# Altium schematic sheet Top.SchDoc: {Наименование}
size 420 x 297 mm; ApprovedBy: {Утвердил}; CheckedBy: {Проверил}; DrawnBy: {Разраб.}; DocumentNumber: НРДЦ.ХХХХХХ.ХХХ 00; SheetNumber: 1; SheetTotal: 8; Scale: {Мш.}; PageSetup: Record=PageOptions|CenterHorizontal=False|CenterVertical=False|PrintScale=0.95|XCorrection=0.00|YCorrection=0.00|PrintKind=1|BorderSize=5000000|LeftOffset=0|BottomOffset=0|Orientation=1|PaperLength=1000|PaperWidth=1000|Scale=100|PaperSource=15|PrintQuality=600|MediaType=1|DitherType=10|PaperKind=A4|PrintScaleMode=1; ProcessInspection: {Т.контр.}; Mass: {М.}; NormInspection: {Н.контр.}; Letter1Column: {}; Letter2Column: {}; Letter3Column: {}; DocumentType: {Документ}; Rule: PcbType=ProtelPcb
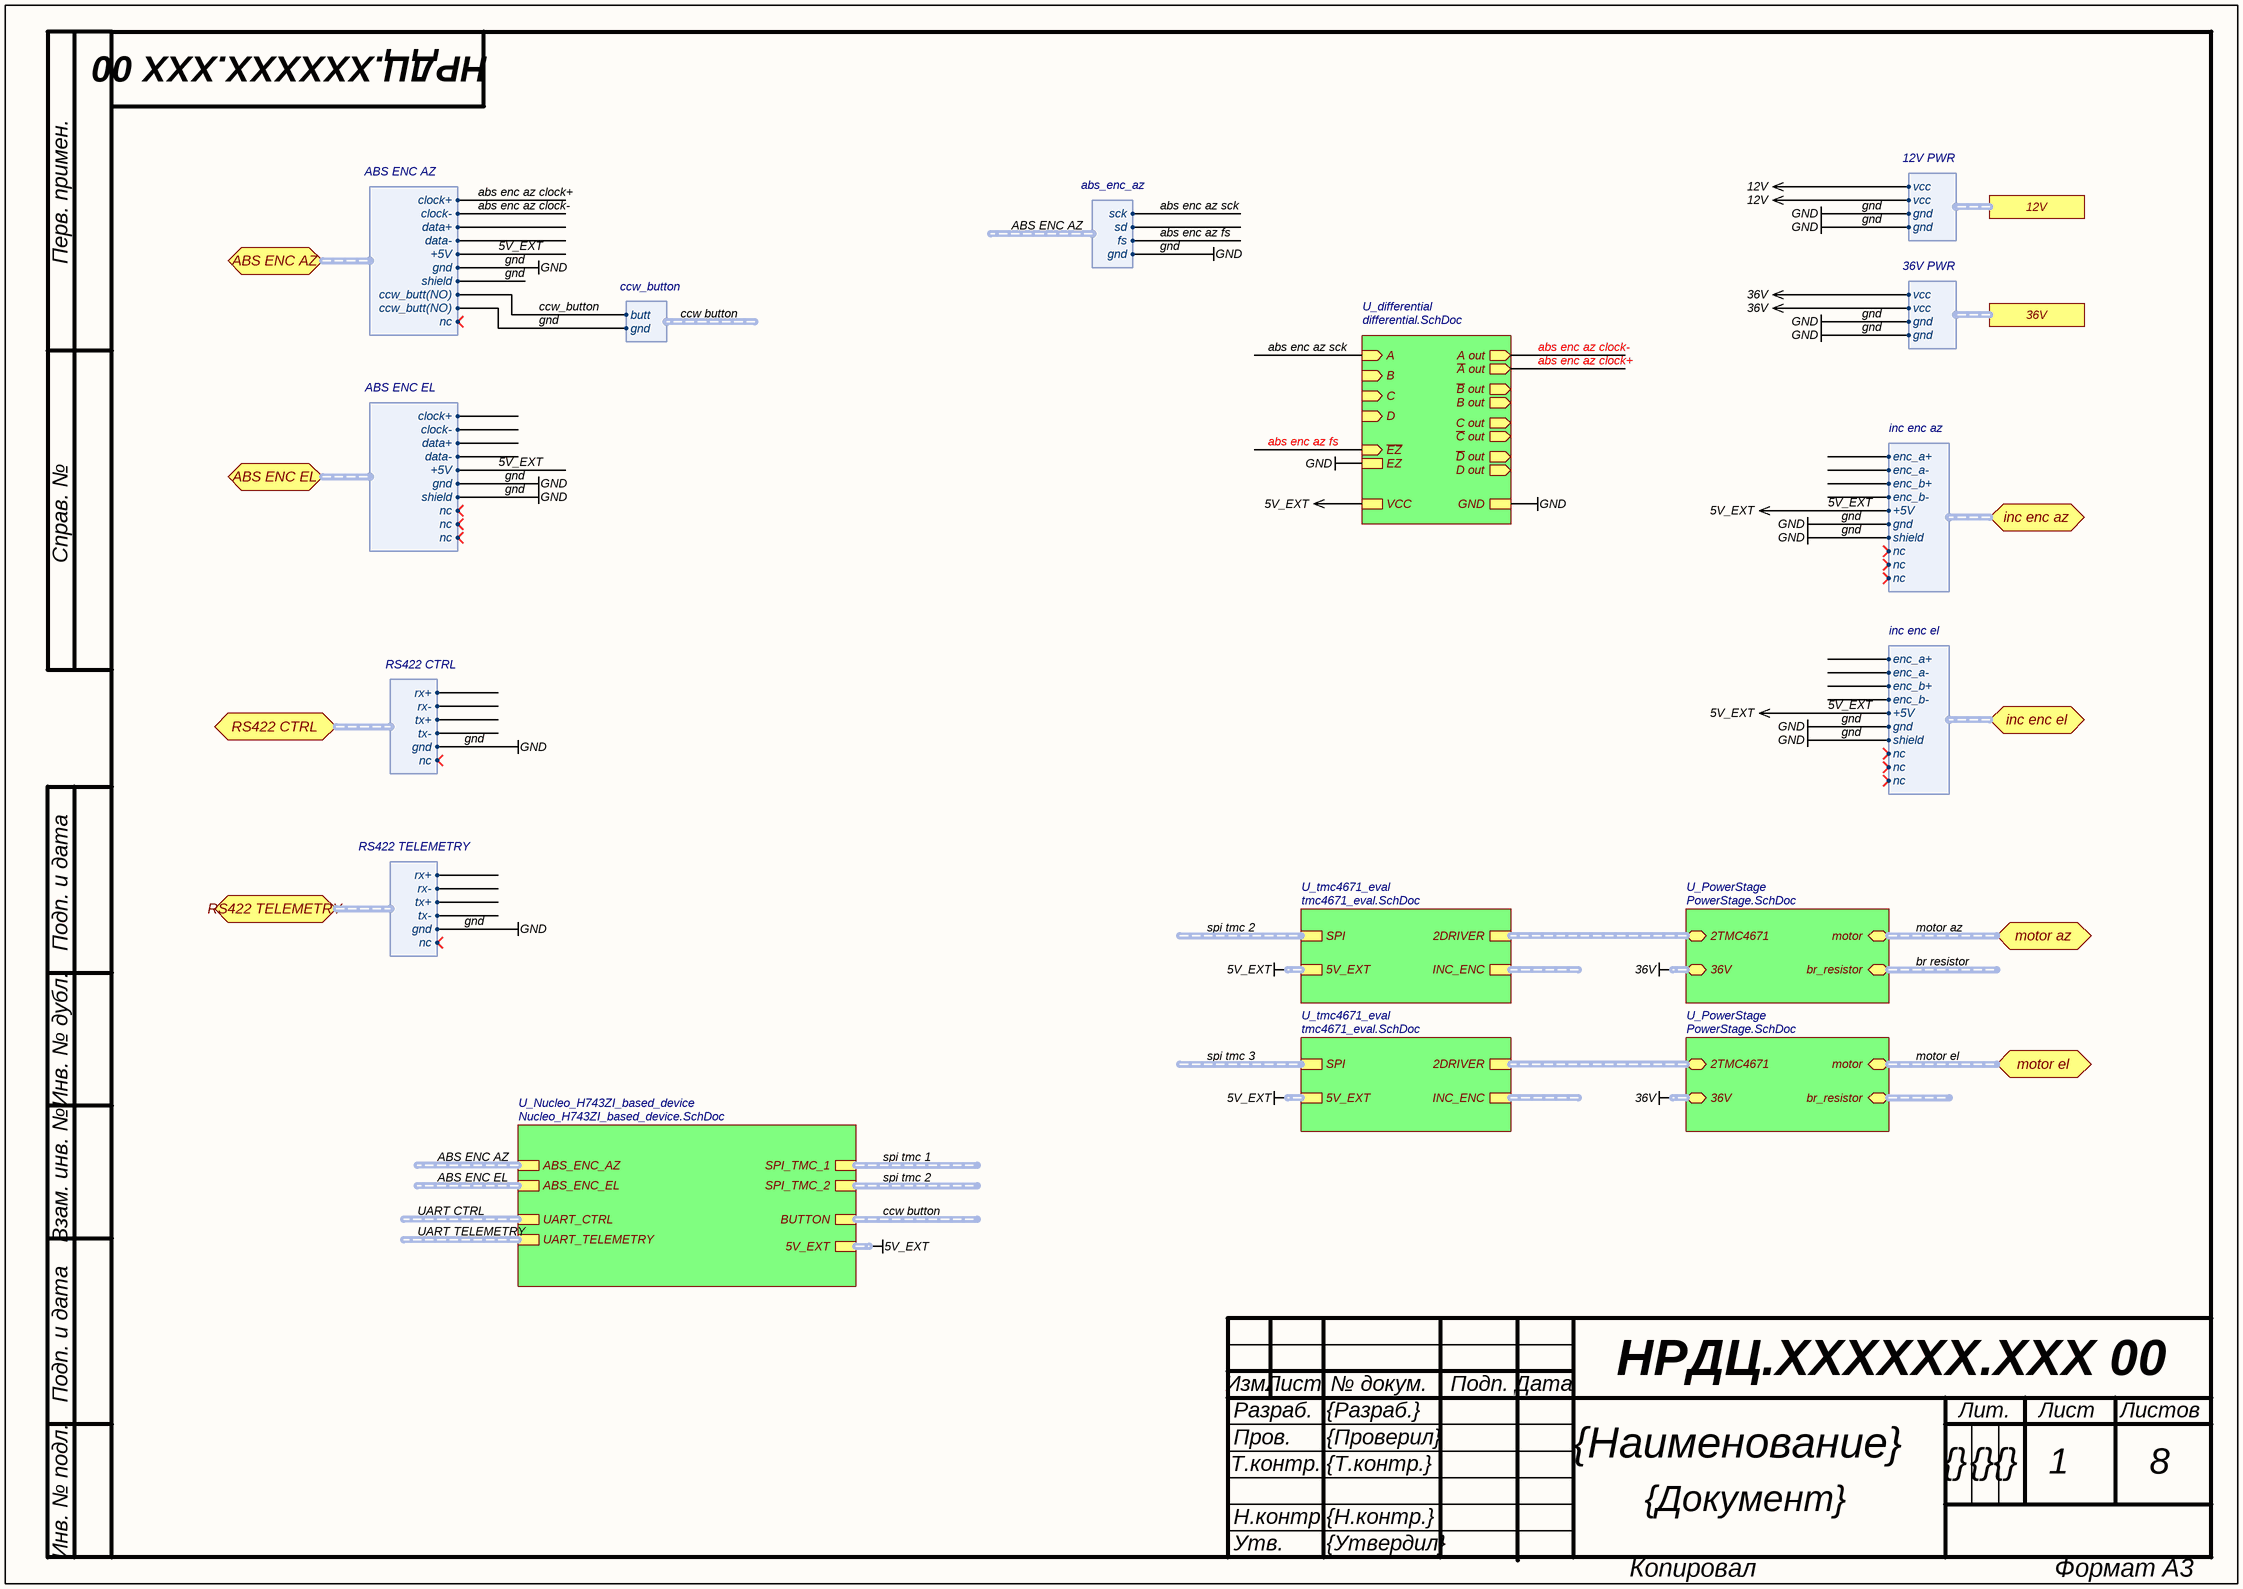
[diagram p0: Top.SchDoc]

## Sub-sheets
U_differential = differential.SchDoc: A (in), A out (out), ~{A} out (out), ~{EZ} (in), ~{B} out (out), B out (out), B (in), GND, C (in), C out (out), ~{C} out (out), ~{D} out (out), D out (out), D (in), VCC, EZ
U_Nucleo_H743ZI_based_device = Nucleo_H743ZI_based_device.SchDoc: ABS_ENC_AZ (harness abs_enc_az), SPI_TMC_1 (harness spi_tmc_1), SPI_TMC_2 (harness spi_tmc_2), ABS_ENC_EL (harness abs_enc_el), UART_TELEMETRY (harness uart_telemetry), UART_CTRL (harness uart_ctrl), BUTTON (harness ccw_button), 5V_EXT (harness 5V_ext)
U_PowerStage = PowerStage.SchDoc: motor (bidir), br_resistor (bidir), 2TMC4671 (bidir), 36V (bidir)
U_PowerStage = PowerStage.SchDoc: motor (bidir), br_resistor (bidir), 2TMC4671 (bidir), 36V (bidir)
U_tmc4671_eval = tmc4671_eval.SchDoc: SPI (harness tmc_spi), 5V_EXT (harness 5V_tmc), 2DRIVER (harness tmc_spi), INC_ENC (harness tmc_inc_enc)
U_tmc4671_eval = tmc4671_eval.SchDoc: SPI (harness tmc_spi), 5V_EXT (harness 5V_tmc), 2DRIVER (harness tmc_spi), INC_ENC (harness tmc_inc_enc)

## Ports
12V (harness 12V PWR), 36V (harness 36V PWR), ABS ENC AZ (bidir, harness ABS ENC AZ), ABS ENC EL (bidir, harness ABS ENC EL), inc enc az (bidir, harness inc enc az), inc enc el (bidir, harness inc enc el), motor az (bidir), motor el (bidir), RS422 CTRL (bidir, harness RS422 CTRL), RS422 TELEMETRY (bidir, harness RS422 TELEMETRY)

## Harnesses
inc enc az: enc_a+, enc_a-, enc_b+, enc_b-, +5V, gnd, shield, nc, nc, nc
inc enc el: enc_a+, enc_a-, enc_b+, enc_b-, +5V, gnd, shield, nc, nc, nc
ABS ENC AZ: clock+, clock-, data+, data-, +5V, gnd, shield, ccw_butt(NO), ccw_butt(NO), nc
ABS ENC EL: clock+, clock-, data+, data-, +5V, gnd, shield, nc, nc, nc
ccw_button: butt, gnd
RS422 CTRL: rx+, rx-, tx+, tx-, gnd, nc
RS422 TELEMETRY: rx+, rx-, tx+, tx-, gnd, nc
12V PWR: vcc, gnd, vcc, gnd
36V PWR: vcc, gnd, vcc, gnd
abs_enc_az: sck, sd, fs, gnd

## Nets
5V_EXT: sheet U_differential/VCC, port inc enc az.+5V, port inc enc el.+5V, port ABS ENC AZ.+5V, port ABS ENC EL.+5V
12V: port 12V.vcc
36V: port 36V.vcc
ccw_button: sheet U_differential/GND, sheet U_differential/EZ, port inc enc az.gnd, port inc enc az.shield, port inc enc el.gnd, port inc enc el.shield, port ABS ENC AZ.gnd, port ABS ENC AZ.shield, port ABS ENC AZ.ccw_butt(NO), port ABS ENC EL.gnd, port ABS ENC EL.shield, sheet U_Nucleo_H743ZI_based_device/BUTTON.butt, sheet U_Nucleo_H743ZI_based_device/BUTTON.gnd, port RS422 CTRL.gnd, port RS422 TELEMETRY.gnd, port 12V.gnd, port 36V.gnd, sheet U_Nucleo_H743ZI_based_device/ABS_ENC_AZ.gnd  [also labelled GND]  [project net ABS ENC AZ.gnd]
abs enc az clock+: sheet U_differential/~{A} out, port ABS ENC AZ.clock+
abs enc az clock-: sheet U_differential/A out, port ABS ENC AZ.clock-
abs enc az fs: sheet U_differential/~{EZ}, sheet U_Nucleo_H743ZI_based_device/ABS_ENC_AZ.fs
abs enc az sck: sheet U_differential/A, sheet U_Nucleo_H743ZI_based_device/ABS_ENC_AZ.sck

## Buses and harness runs
harness ABS ENC AZ = sheet U_Nucleo_H743ZI_based_device/ABS_ENC_AZ
harness ABS ENC EL = sheet U_Nucleo_H743ZI_based_device/ABS_ENC_EL
harness br resistor = sheet U_PowerStage/br_resistor
harness ccw button = sheet U_Nucleo_H743ZI_based_device/BUTTON
harness motor az = port motor az = sheet U_PowerStage/motor
harness motor el = port motor el = sheet U_PowerStage/motor
harness sheet U_PowerStage/2TMC4671 = sheet U_tmc4671_eval/2DRIVER
harness spi tmc 1 = sheet U_Nucleo_H743ZI_based_device/SPI_TMC_1
harness spi tmc 2 = sheet U_Nucleo_H743ZI_based_device/SPI_TMC_2
harness spi tmc 2 = sheet U_tmc4671_eval/SPI
harness spi tmc 3 = sheet U_tmc4671_eval/SPI
harness UART CTRL = sheet U_Nucleo_H743ZI_based_device/UART_CTRL
harness UART TELEMETRY = sheet U_Nucleo_H743ZI_based_device/UART_TELEMETRY

## Notes on the sheet
- Labels drawn without touching a wire or pin: 5V_EXT, 36V
- Перв. примен.
- Справ. №
- Подп. и дата
- Инв. № дубл.
- Взам. инв. №
- Изм.
- Лист
- № докум.
- Подп.
- Дата
- Т.контр.
- Пров.
- Разраб.
- Лит.
- Листов
- Инв. № подл.
- Н.контр.
- Утв.
- Копировал
- Формат А3